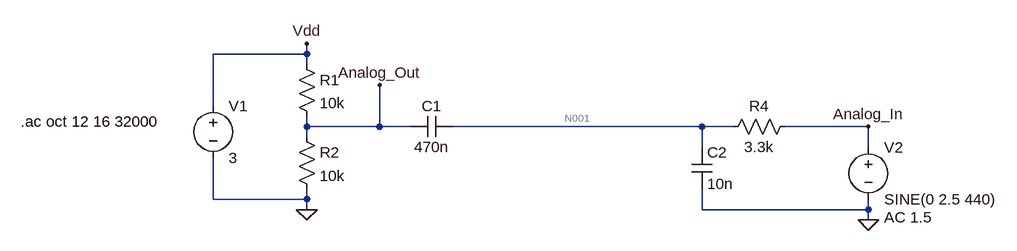
[diagram p0: schematic Analog_Shift.asc]
Analog_Shift.asc, the LTspice schematic file:
Version 4
SHEET 1 1212 680
WIRE 96 80 96 64
WIRE 96 80 -48 80
WIRE 96 96 96 80
WIRE -48 160 -48 80
WIRE 96 192 96 176
WIRE 208 192 208 128
WIRE 208 192 96 192
WIRE 256 192 208 192
WIRE 704 192 320 192
WIRE 752 192 704 192
WIRE 960 192 832 192
WIRE 96 208 96 192
WIRE 704 224 704 192
WIRE 960 224 960 192
WIRE -48 304 -48 240
WIRE 96 304 96 288
WIRE 96 304 -48 304
WIRE 96 320 96 304
WIRE 704 320 704 288
WIRE 960 320 960 304
WIRE 960 320 704 320
WIRE 960 336 960 320
FLAG 96 320 0
FLAG 96 64 Vdd
FLAG 960 336 0
FLAG 960 192 Analog_In
FLAG 208 128 Analog_Out
SYMBOL res 80 80 R0
SYMATTR InstName R1
SYMATTR Value 10k
SYMBOL res 80 192 R0
SYMATTR InstName R2
SYMATTR Value 10k
SYMBOL voltage -48 144 R0
WINDOW 123 0 0 Left 2
WINDOW 39 0 0 Left 2
SYMATTR InstName V1
SYMATTR Value 3
SYMBOL voltage 960 208 R0
WINDOW 123 24 124 Left 2
WINDOW 39 0 0 Left 2
SYMATTR Value2 AC 1.5
SYMATTR InstName V2
SYMATTR Value SINE(0 2.5 440)
SYMBOL cap 688 224 R0
SYMATTR InstName C2
SYMATTR Value 10n
SYMBOL res 736 208 R270
WINDOW 0 32 56 VTop 2
WINDOW 3 0 56 VBottom 2
SYMATTR InstName R4
SYMATTR Value 3.3k
SYMBOL cap 320 176 R90
WINDOW 0 0 32 VBottom 2
WINDOW 3 32 32 VTop 2
SYMATTR InstName C1
SYMATTR Value 470n
TEXT -344 184 Left 2 !.ac oct 12 16 32000

The netlist it stands for:
* Analog_Shift.asc
R1 Vdd Analog_Out 10k
R2 Analog_Out 0 10k
V1 Vdd 0 3
V2 Analog_In 0 SINE(0 2.5 440) AC 1.5
C2 N001 0 10n
R4 N001 Analog_In 3.3k
C1 N001 Analog_Out 470n
.ac oct 12 16 32000
.backanno
.end

* Results of the author's LTspice run, read from the files saved beside the schematic
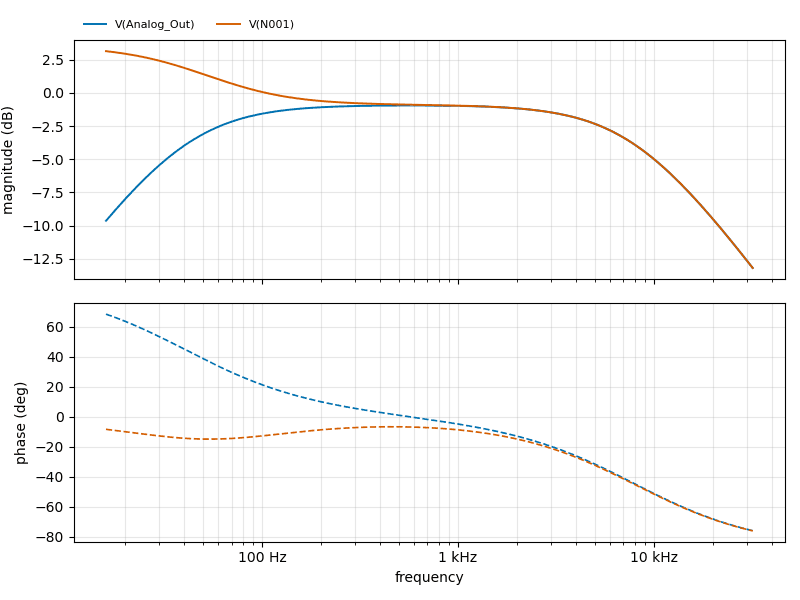
[diagram p1: AC Analysis of Analog_Shift.asc, plotted from the saved traces]
* AC Analysis, 1 run:
*   V(Analog_Out): -9.64 dB at 16 Hz, -13.18 dB at 32 kHz, peak -0.95 dB at 574.7 Hz, 3 dB below the peak at 40.26 Hz and 8.112 kHz
*   V(N001): 3.13 dB at 16 Hz, -13.18 dB at 32 kHz, peak 3.13 dB at 16 Hz, 3 dB below the peak at 96.33 Hz